# EAGLE design untitled (EAGLE 6.2)
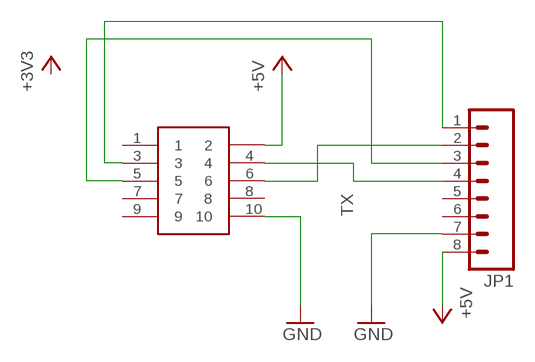
[diagram p0: schematic, sheet 1]

## Parts
JP1  M081X08  [1X08]
U$1  SHF105SM  [SHF105DSM]

## Nets
+5V: JP1.8 U$1.2
D1: JP1.1 U$1.3
D2: JP1.2 U$1.6
GND: JP1.7 U$1.10
RX: JP1.3 U$1.5
TX: JP1.4 U$1.4
Unconnected: JP1.5 JP1.6 U$1.1 U$1.7 U$1.8 U$1.9

## Library data of the parts
JP1 = SparkFun-Connectors:M08: Header 8 Standard 8-pin 0.1" header. Use with straight break away headers (SKU : PRT-00116), right angle break away headers (PRT-00553), swiss pins (PRT-00743), machine pins (PRT-00117), and female headers (PRT-00115).
U$1 = Gadgeteer:SHF105

## Board
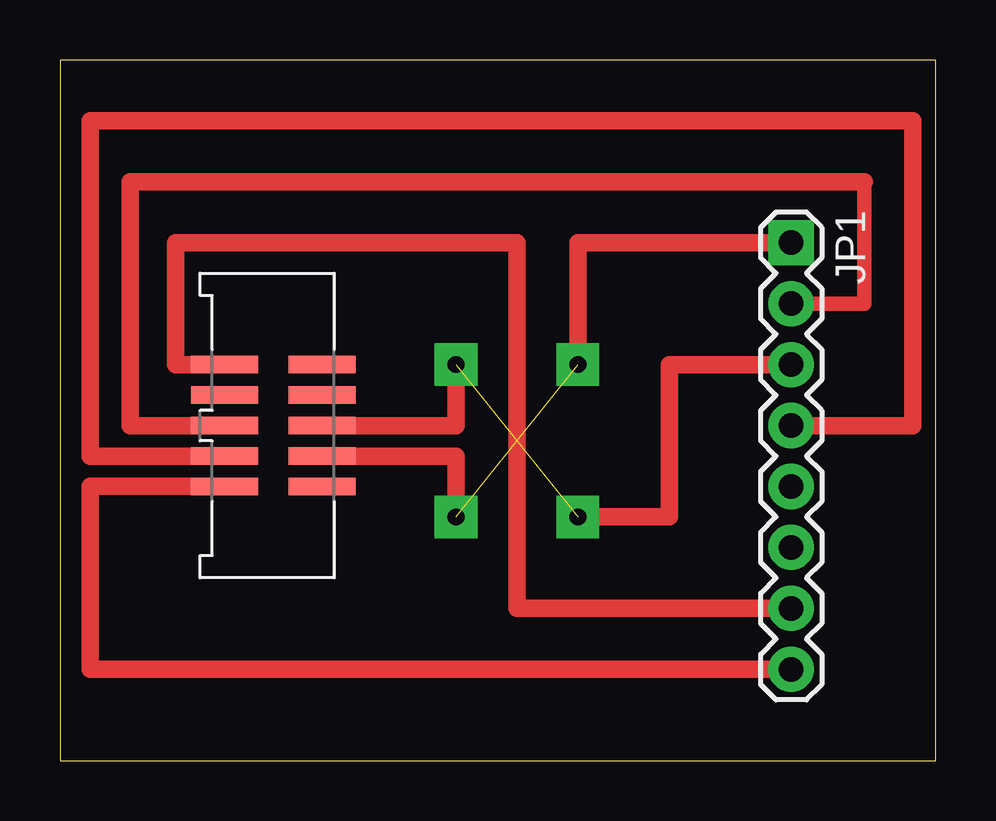
[diagram p1: board, top side]

Size 36.5 x 29.2 mm. Coordinates in mm from the lower left corner, seen from the top.
Outline: 0,0 36.5,0 36.5,29.2 0,29.2 0,0
Copper layers (1*16): Top 0.035mm / dielectric 1.5mm / Bottom 0.035mm
Design rules: minimum track width 10mil, minimum drill 24mil, track to track 8mil, track to pad 8mil, pad to pad 8mil, via to via 8mil, smd to smd 8mil, copper to edge 40mil, drill to drill 8mil, minimum pad ring 10mil, minimum via ring 8mil, stop-mask expansion 4mil, vias tented up to drill 0mil, thermal gap 10mil

### Footprints (pad centres in the part's own frame; a part is rotated, then mirrored left to right if it is on the bottom)
1X08 = drill 1.016 pad 1.88 square: 1 0,0 | drill 1.016 pad 1.88: 2 2.54,0; 3 5.08,0; 4 7.62,0; 5 10.16,0; 6 12.7,0; 7 15.24,0; 8 17.78,0
SHF105DSM = smd 2.794 x 0.737: 1 -2.032,2.54; 2 2.032,2.54; 3 -2.032,1.27; 4 2.032,1.27; 5 -2.032,0; 6 2.032,0; 7 -2.032,-1.27; 8 2.032,-1.27; 9 -2.032,-2.54; 10 2.032,-2.54

### Placement (x,y rotation side)
JP1  30.48,21.59 270 top
U$1  8.89,13.97 180 top

### Tracks (layer width: path | path; a pad name or v marks a point on that pad's centre or on a via)
+5V
  Top 0.737: JP1.8 1.27,3.81 1.27,11.43 U$1.2
D1  (1 unrouted)
  Top 0.737: U$1.3 16.51,12.7 16.51,10.16 | 21.59,16.51 21.59,21.59 JP1.1
D2
  Top 0.61: 33.53,24.13 33.53,19.05 JP1.2
  Top 0.737: U$1.6 2.92,13.97 2.92,24.13 33.53,24.13
GND
  Top 0.737: U$1.10 4.83,16.51 4.83,21.59 19.05,21.59 19.05,6.35 JP1.7
N$1  (via drill 0.7 pad 1.78)
  other vias: 16.51,16.51
N$2  (via drill 0.7 pad 1.78)
  other vias: 16.51,10.16
N$3  (via drill 0.7 pad 1.78)
  other vias: 21.59,10.16
N$4  (via drill 0.7 pad 1.78)
  other vias: 21.59,16.51
RX  (1 unrouted)
  Top 0.737: U$1.5 16.51,13.97 16.51,16.51 | 21.59,10.16 25.4,10.16 25.4,16.51 JP1.3
TX
  Top 0.61: U$1.4 6.35,12.7
  Top 0.737: JP1.4 35.56,13.97 35.56,26.67 1.27,26.67 1.27,12.7 6.35,12.7